# Altium project PCB_Concentrator.PrjPcb (part 3 of 3)
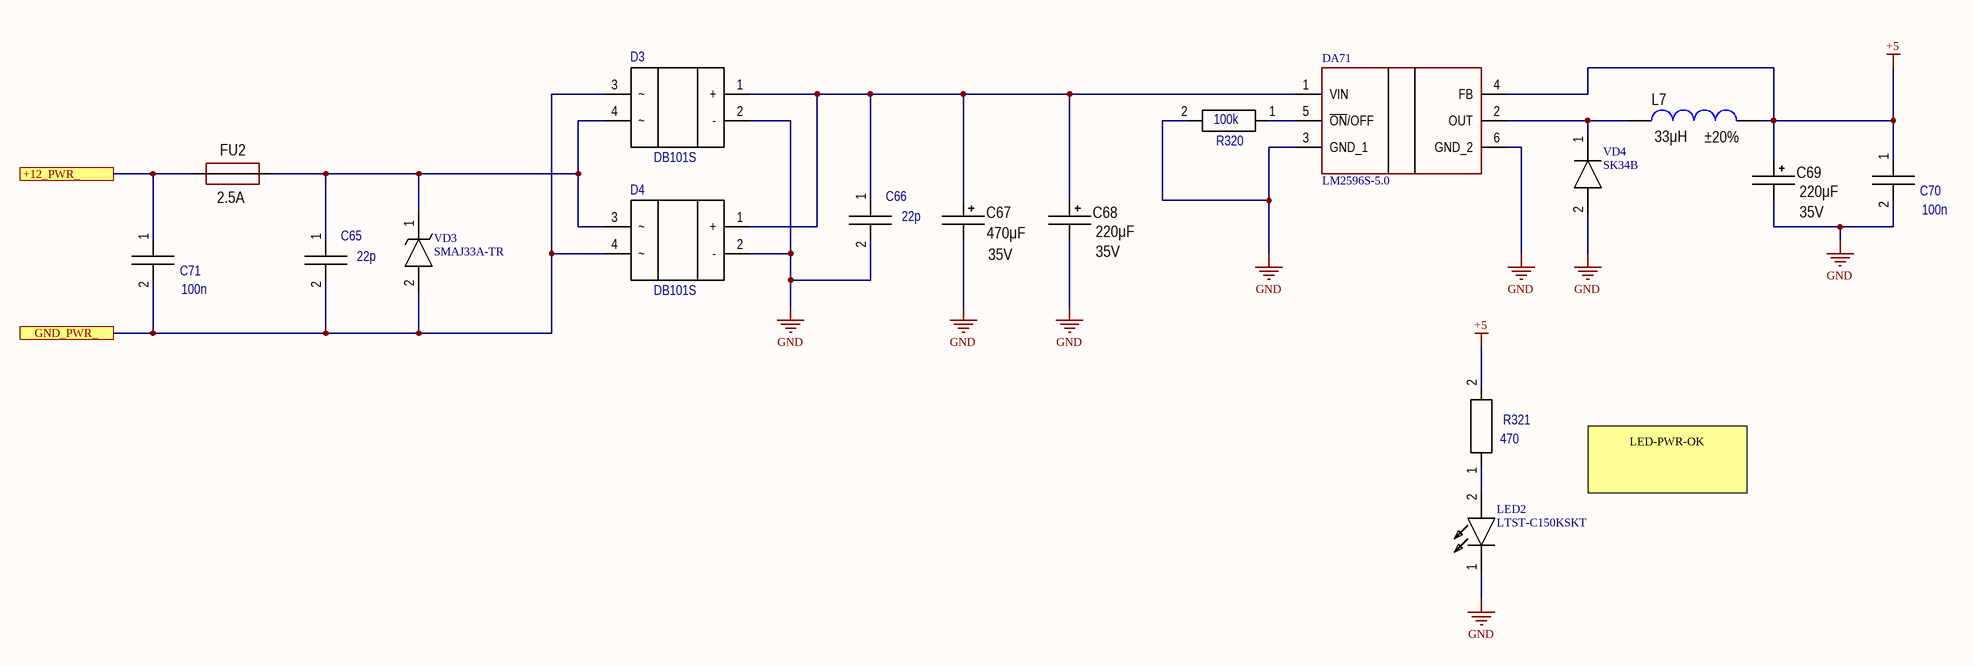
[diagram p14: 11_PWR_SYS.SchDoc]

## Nets that join several sheets
+5: 02_Inputs_1-9 (27 pins), 03_Inputs_10-18 (27 pins), 04_Inputs_19-27 (27 pins), 05_Inputs_28-35 (24 pins), 07_RS485 (6 pins), 08_Extention_GPIO (C43.1 L2.1), 09_MCU (5 pins), 11_PWR_SYS (5 pins)
+12V_INPUTS: 02_Inputs_1-9 (18 pins), 03_Inputs_10-18 (18 pins), 04_Inputs_19-27 (18 pins), 05_Inputs_28-35 (16 pins), 06_PWR_Inputs_12V (C42.1 L1.2)
GND: 02_Inputs_1-9 (18 pins), 03_Inputs_10-18 (18 pins), 04_Inputs_19-27 (18 pins), 05_Inputs_28-35 (16 pins), 07_RS485 (C36.1 C37.2 D1.1 DD1.5), 08_Extention_GPIO (16 pins), 09_MCU (C59.1 L4.1), 11_PWR_SYS (12 pins)
GND_INPUTS: 02_Inputs_1-9 (18 pins), 03_Inputs_10-18 (18 pins), 04_Inputs_19-27 (18 pins), 05_Inputs_28-35 (16 pins), 06_PWR_Inputs_12V (C42.2 D2.2 VD2.2)
1: 02_Inputs_1-9 (R55.2), 10_Connectors (X6.1)
2: 02_Inputs_1-9 (VT9.3), 10_Connectors (X6.2)
3: 02_Inputs_1-9 (R73.2), 10_Connectors (X6.3)
4: 02_Inputs_1-9 (VT12.3), 10_Connectors (X6.4)
5: 02_Inputs_1-9 (R91.2), 10_Connectors (X6.5)
6: 02_Inputs_1-9 (VT15.3), 10_Connectors (X6.6)
7: 02_Inputs_1-9 (R56.2), 10_Connectors (X6.7)
8: 02_Inputs_1-9 (VT10.3), 10_Connectors (X6.8)
9: 02_Inputs_1-9 (R74.2), 10_Connectors (X6.9)
10: 02_Inputs_1-9 (VT13.3), 10_Connectors (X6.10)
11: 02_Inputs_1-9 (R92.2), 10_Connectors (X8.1)
12: 02_Inputs_1-9 (VT16.3), 10_Connectors (X8.2)
13: 02_Inputs_1-9 (R57.2), 10_Connectors (X8.3)
14: 02_Inputs_1-9 (VT11.3), 10_Connectors (X8.4)
15: 02_Inputs_1-9 (R77.2), 10_Connectors (X8.5)
16: 02_Inputs_1-9 (VT14.3), 10_Connectors (X8.6)
17: 02_Inputs_1-9 (R93.2), 10_Connectors (X8.7)
18: 02_Inputs_1-9 (VT17.3), 10_Connectors (X8.8)
19: 03_Inputs_10-18 (R127.2), 10_Connectors (X8.9)
20: 03_Inputs_10-18 (VT21.3), 10_Connectors (X8.10)
21: 03_Inputs_10-18 (R145.2), 10_Connectors (X10.1)
22: 03_Inputs_10-18 (VT24.3), 10_Connectors (X10.2)
23: 03_Inputs_10-18 (R110.2), 10_Connectors (X10.3)
24: 03_Inputs_10-18 (VT19.3), 10_Connectors (X10.4)
25: 03_Inputs_10-18 (R128.2), 10_Connectors (X10.5)
26: 03_Inputs_10-18 (VT22.3), 10_Connectors (X10.6)
27: 03_Inputs_10-18 (R146.2), 10_Connectors (X10.7)
28: 03_Inputs_10-18 (VT25.3), 10_Connectors (X10.8)
29: 03_Inputs_10-18 (R111.2), 10_Connectors (X10.9)
30: 03_Inputs_10-18 (VT20.3), 10_Connectors (X10.10)
31: 03_Inputs_10-18 (R131.2), 10_Connectors (X3.9)
32: 03_Inputs_10-18 (VT23.3), 10_Connectors (X3.10)
33: 03_Inputs_10-18 (R147.2), 10_Connectors (X3.7)
34: 03_Inputs_10-18 (VT26.3), 10_Connectors (X3.8)
35: 03_Inputs_10-18 (R109.2), 10_Connectors (X3.5)
36: 03_Inputs_10-18 (VT18.3), 10_Connectors (X3.6)
37: 04_Inputs_19-27 (R163.2), 10_Connectors (X3.3)
38: 04_Inputs_19-27 (VT27.3), 10_Connectors (X3.4)
39: 04_Inputs_19-27 (R181.2), 10_Connectors (X3.1)
40: 04_Inputs_19-27 (VT30.3), 10_Connectors (X3.2)
41: 04_Inputs_19-27 (R199.2), 10_Connectors (X5.9)
42: 04_Inputs_19-27 (VT33.3), 10_Connectors (X5.10)
43: 04_Inputs_19-27 (R164.2), 10_Connectors (X5.7)
44: 04_Inputs_19-27 (VT28.3), 10_Connectors (X5.8)
45: 04_Inputs_19-27 (R182.2), 10_Connectors (X5.5)
46: 04_Inputs_19-27 (VT31.3), 10_Connectors (X5.6)
47: 04_Inputs_19-27 (R200.2), 10_Connectors (X5.3)
48: 04_Inputs_19-27 (VT34.3), 10_Connectors (X5.4)
49: 04_Inputs_19-27 (R165.2), 10_Connectors (X5.1)
50: 04_Inputs_19-27 (VT29.3), 10_Connectors (X5.2)
51: 04_Inputs_19-27 (R185.2), 10_Connectors (X7.9)
52: 04_Inputs_19-27 (VT32.3), 10_Connectors (X7.10)
53: 04_Inputs_19-27 (R201.2), 10_Connectors (X7.7)
54: 04_Inputs_19-27 (VT35.3), 10_Connectors (X7.8)
55: 05_Inputs_28-35 (R6.2), 10_Connectors (X7.5)
56: 05_Inputs_28-35 (VT1.3), 10_Connectors (X7.6)
57: 05_Inputs_28-35 (R23.2), 10_Connectors (X7.3)
58: 05_Inputs_28-35 (VT4.3), 10_Connectors (X7.4)
59: 05_Inputs_28-35 (R41.2), 10_Connectors (X7.1)
60: 05_Inputs_28-35 (VT7.3), 10_Connectors (X7.2)
61: 05_Inputs_28-35 (R7.2), 10_Connectors (X9.9)
62: 05_Inputs_28-35 (VT2.3), 10_Connectors (X9.10)
63: 05_Inputs_28-35 (R24.2), 10_Connectors (X9.7)
64: 05_Inputs_28-35 (VT5.3), 10_Connectors (X9.8)
65: 05_Inputs_28-35 (R42.2), 10_Connectors (X9.5)
66: 05_Inputs_28-35 (VT8.3), 10_Connectors (X9.6)
67: 05_Inputs_28-35 (R13.2), 10_Connectors (X9.3)
68: 05_Inputs_28-35 (VT3.3), 10_Connectors (X9.4)
69: 05_Inputs_28-35 (R33.2), 10_Connectors (X9.1)
70: 05_Inputs_28-35 (VT6.3), 10_Connectors (X9.2)
71: 07_RS485 (R215.1), 10_Connectors (X4.3 X4.6)
72: 07_RS485 (R216.1), 10_Connectors (X4.4 X4.7)
73: 07_RS485 (R322.2), 10_Connectors (X4.5 X4.8)
74: 06_PWR_Inputs_12V (FU1.1), 10_Connectors (X4.9)
75: 06_PWR_Inputs_12V (C41.2 D2.4), 10_Connectors (X4.10)
76: 10_Connectors (X4.1), 11_PWR_SYS (C71.1 FU2.1)
77: 10_Connectors (X4.2), 11_PWR_SYS (5 pins)
NetR15_2: 05_Inputs_28-35 (R15.2), 08_Extention_GPIO (R265.2)
NetR16_2: 05_Inputs_28-35 (R16.2), 08_Extention_GPIO (R258.2)
NetR20_2: 05_Inputs_28-35 (R20.2), 08_Extention_GPIO (R270.2)
NetR31_2: 05_Inputs_28-35 (R31.2), 08_Extention_GPIO (R264.2)
NetR32_2: 05_Inputs_28-35 (R32.2), 08_Extention_GPIO (R260.2)
NetR40_2: 05_Inputs_28-35 (R40.2), 08_Extention_GPIO (R272.2)
NetR47_2: 05_Inputs_28-35 (R47.2), 08_Extention_GPIO (R271.2)
NetR48_2: 05_Inputs_28-35 (R48.2), 08_Extention_GPIO (R259.2)
NetR64_2: 02_Inputs_1-9 (R64.2), 08_Extention_GPIO (R229.2)
NetR65_2: 02_Inputs_1-9 (R65.2), 08_Extention_GPIO (R227.2)
NetR66_2: 02_Inputs_1-9 (R66.2), 08_Extention_GPIO (R232.2)
NetR82_2: 02_Inputs_1-9 (R82.2), 08_Extention_GPIO (R223.2)
NetR83_2: 02_Inputs_1-9 (R83.2), 08_Extention_GPIO (R231.2)
NetR84_2: 02_Inputs_1-9 (R84.2), 08_Extention_GPIO (R225.2)
NetR100_2: 02_Inputs_1-9 (R100.2), 08_Extention_GPIO (R224.2)
NetR101_2: 02_Inputs_1-9 (R101.2), 08_Extention_GPIO (R244.2)
NetR102_2: 02_Inputs_1-9 (R102.2), 08_Extention_GPIO (R230.2)
NetR118_2: 03_Inputs_10-18 (R118.2), 08_Extention_GPIO (R247.2)
NetR119_2: 03_Inputs_10-18 (R119.2), 08_Extention_GPIO (R236.2)
NetR120_2: 03_Inputs_10-18 (R120.2), 08_Extention_GPIO (R243.2)
NetR136_2: 03_Inputs_10-18 (R136.2), 08_Extention_GPIO (R235.2)
NetR137_2: 03_Inputs_10-18 (R137.2), 08_Extention_GPIO (R242.2)
NetR138_2: 03_Inputs_10-18 (R138.2), 08_Extention_GPIO (R238.2)
NetR154_2: 03_Inputs_10-18 (R154.2), 08_Extention_GPIO (R241.2)
NetR155_2: 03_Inputs_10-18 (R155.2), 08_Extention_GPIO (R237.2)
NetR156_2: 03_Inputs_10-18 (R156.2), 08_Extention_GPIO (R252.2)
NetR172_2: 04_Inputs_19-27 (R172.2), 08_Extention_GPIO (R249.2)
NetR173_2: 04_Inputs_19-27 (R173.2), 08_Extention_GPIO (R253.2)
NetR174_2: 04_Inputs_19-27 (R174.2), 08_Extention_GPIO (R262.2)
NetR190_2: 04_Inputs_19-27 (R190.2), 08_Extention_GPIO (R248.2)
NetR191_2: 04_Inputs_19-27 (R191.2), 08_Extention_GPIO (R255.2)
NetR192_2: 04_Inputs_19-27 (R192.2), 08_Extention_GPIO (R257.2)
NetR208_2: 04_Inputs_19-27 (R208.2), 08_Extention_GPIO (R254.2)
NetR209_2: 04_Inputs_19-27 (R209.2), 08_Extention_GPIO (R250.2)
NetR210_2: 04_Inputs_19-27 (R210.2), 08_Extention_GPIO (R263.2)
NetR220_1: 08_Extention_GPIO (R220.1), 09_MCU (R309.1)
NetR221_1: 08_Extention_GPIO (R221.1), 09_MCU (R310.1)
NetR222_1: 08_Extention_GPIO (R222.1), 09_MCU (R311.1)
NetR228_1: 08_Extention_GPIO (R228.1), 09_MCU (R308.1)
RXD: 07_RS485 (DD1.6 R211.1 X11.1), 09_MCU (R300.2)
TXD: 07_RS485 (DD2.3 X11.2), 09_MCU (R301.2)